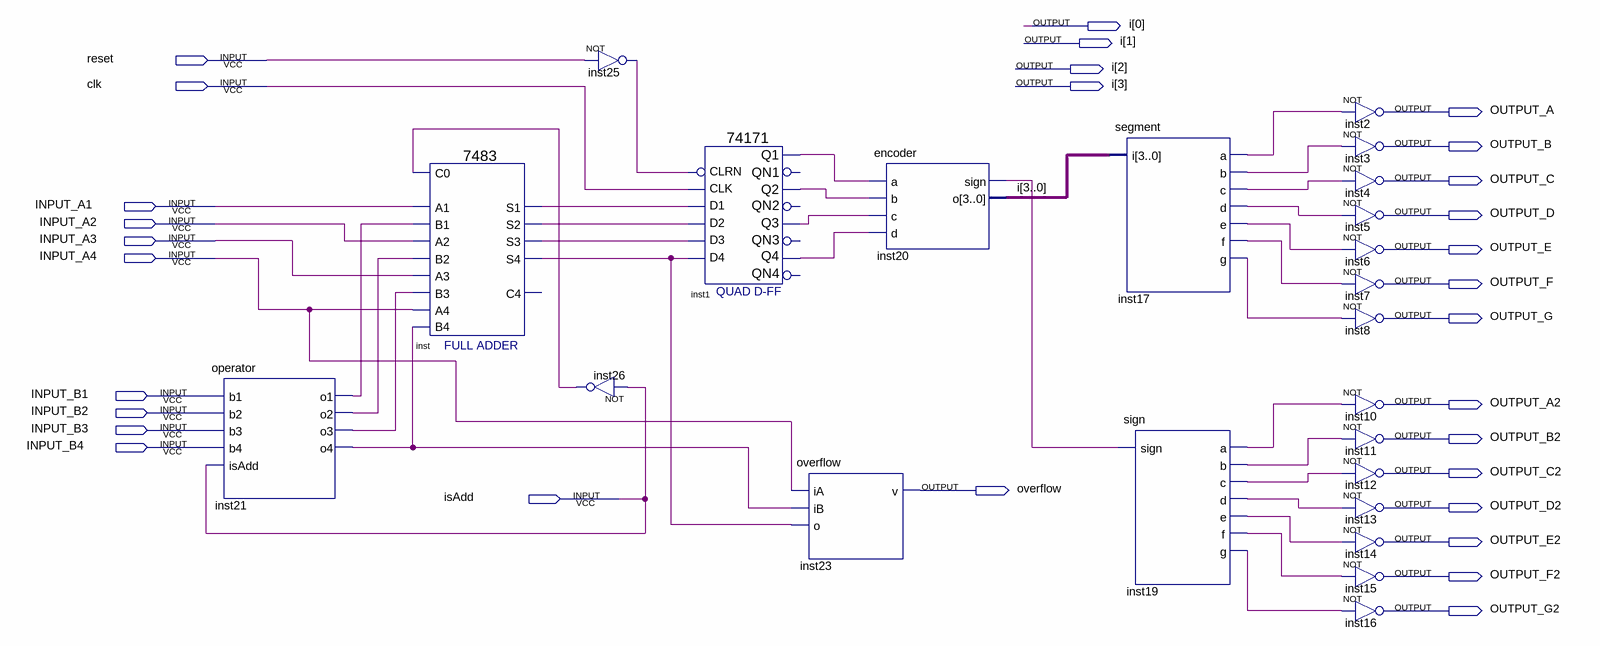
[diagram p0: schematic sheet]
// Quartus schematic YL_adder.bdf as structural Verilog: 23 symbols, 30 pins
module YL_adder (
  input  reset,
  input  clk,
  input  INPUT_A1,
  input  INPUT_A2,
  input  INPUT_A3,
  input  INPUT_A4,
  input  INPUT_B1,
  input  INPUT_B2,
  input  INPUT_B3,
  input  INPUT_B4,
  input  isAdd,
  output [3:0] i,
  output OUTPUT_A,
  output OUTPUT_B,
  output OUTPUT_C,
  output OUTPUT_D,
  output OUTPUT_E,
  output OUTPUT_F,
  output OUTPUT_G,
  output OUTPUT_A2,
  output OUTPUT_B2,
  output OUTPUT_C2,
  output overflow,
  output OUTPUT_D2,
  output OUTPUT_E2,
  output OUTPUT_F2,
  output OUTPUT_G2
);

  wire inst1_q1, inst1_q2, inst1_q3, inst1_q4, inst17_a, inst17_b, inst17_c, inst17_d, inst17_e, inst17_f,
       inst17_g, inst19_a, inst19_b, inst19_c, inst19_d, inst19_e, inst19_f, inst19_g, inst20_sign,
       inst21_o1, inst21_o2, inst21_o3, inst21_o4, inst25_out, inst26_out, inst_s1, inst_s2, inst_s3, inst_s4;

  operator inst21 (
    .b1(INPUT_B1), .b2(INPUT_B2), .b3(INPUT_B3), .b4(INPUT_B4), .isAdd(isAdd), .o1(inst21_o1),
    .o2(inst21_o2), .o3(inst21_o3), .o4(inst21_o4));
  \7483  inst (
    .B4(inst21_o4), .C0(inst26_out), .A1(INPUT_A1), .A2(INPUT_A2), .B1(inst21_o1), .B2(inst21_o2),
    .A3(INPUT_A3), .B3(inst21_o3), .A4(INPUT_A4), .S3(inst_s3), .S4(inst_s4), .S2(inst_s2), .S1(inst_s1));  // open: C4
  not inst25 (inst25_out, reset);
  not inst26 (inst26_out, isAdd);
  \74171  inst1 (
    .CLRN(inst25_out), .D1(inst_s1), .CLK(clk), .D2(inst_s2), .D4(inst_s4), .D3(inst_s3), .Q3(inst1_q3),
    .Q4(inst1_q4), .Q2(inst1_q2), .Q1(inst1_q1));  // open: QN4, QN3, QN1, QN2
  overflow inst23 (.iA(INPUT_A4), .iB(inst21_o4), .o(inst_s4), .v(overflow));
  encoder inst20 (.a(inst1_q1), .b(inst1_q2), .c(inst1_q3), .d(inst1_q4), .sign(inst20_sign), .o(i));
  segment inst17 (
    .i(i), .a(inst17_a), .b(inst17_b), .c(inst17_c), .d(inst17_d), .e(inst17_e), .f(inst17_f), .g(inst17_g));
  sign inst19 (
    .sign(inst20_sign), .a(inst19_a), .b(inst19_b), .c(inst19_c), .d(inst19_d), .e(inst19_e), .f(inst19_f),
    .g(inst19_g));
  not inst2 (OUTPUT_A, inst17_a);
  not inst3 (OUTPUT_B, inst17_b);
  not inst4 (OUTPUT_C, inst17_c);
  not inst5 (OUTPUT_D, inst17_d);
  not inst6 (OUTPUT_E, inst17_e);
  not inst7 (OUTPUT_F, inst17_f);
  not inst8 (OUTPUT_G, inst17_g);
  not inst10 (OUTPUT_A2, inst19_a);
  not inst11 (OUTPUT_B2, inst19_b);
  not inst12 (OUTPUT_C2, inst19_c);
  not inst13 (OUTPUT_D2, inst19_d);
  not inst14 (OUTPUT_E2, inst19_e);
  not inst15 (OUTPUT_F2, inst19_f);
  not inst16 (OUTPUT_G2, inst19_g);
endmodule
